# Altium project DS158-1.0-B心电图传感器.PrjPcb
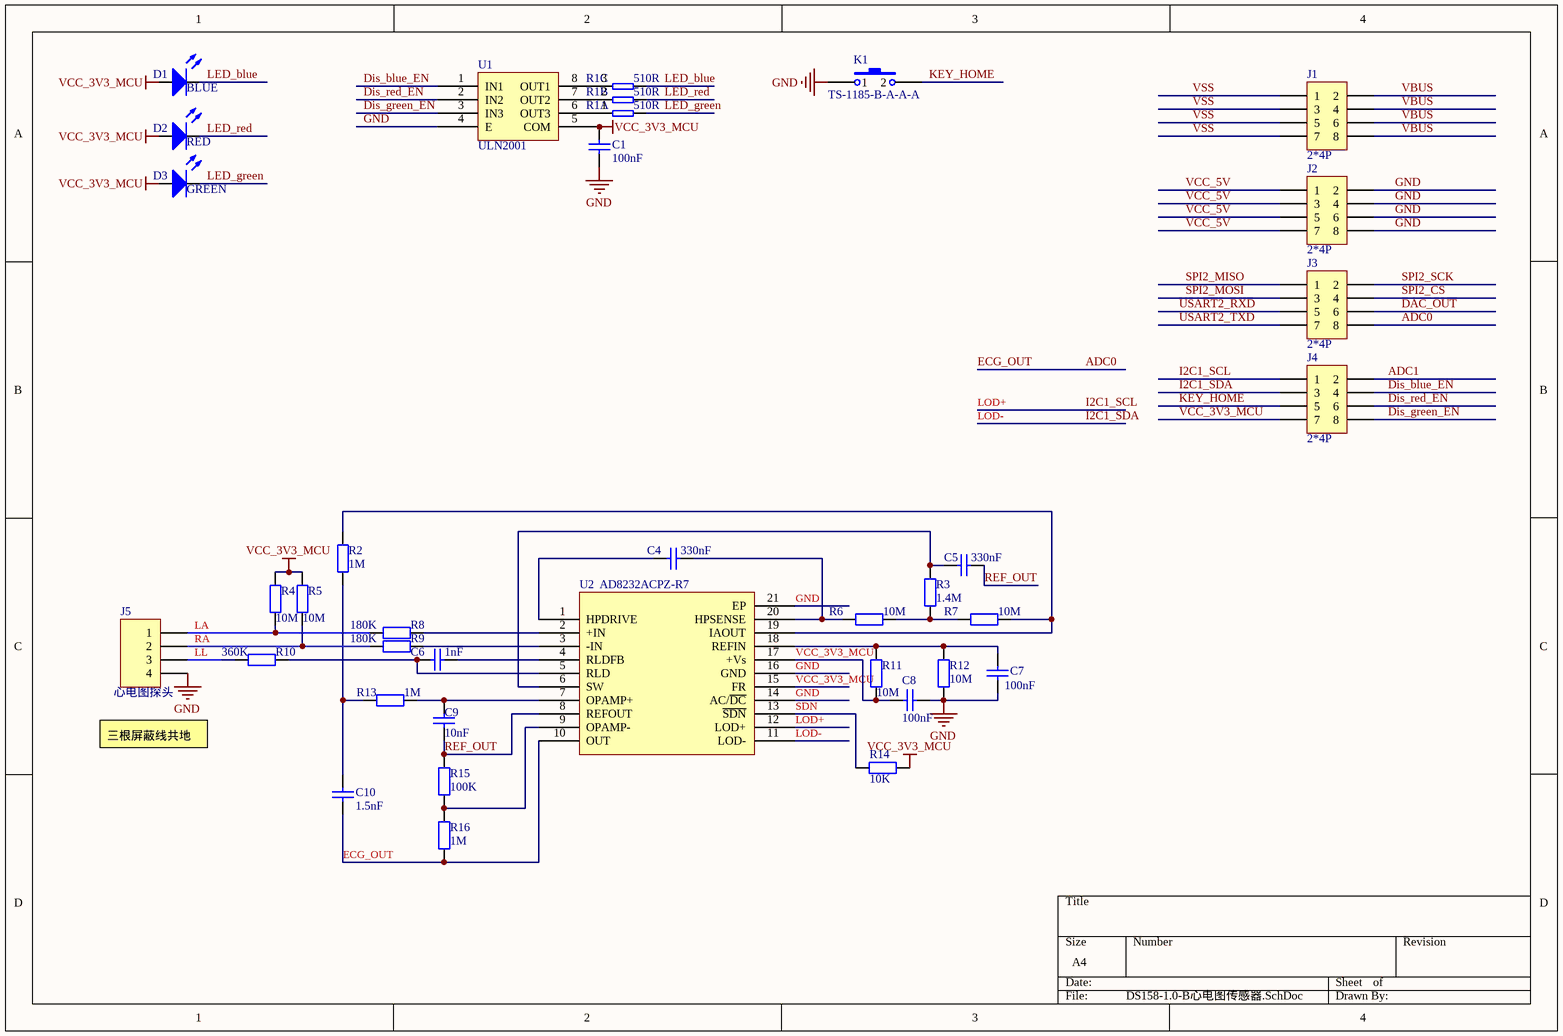
[diagram p0: DS158-1.0-B心电图传感器.SchDoc]
1 sheet, 35 parts. Net scope: global (net labels, ports and power ports of the same name join across sheets).
Board file: DS158-1.0-B心电图传感器.PcbDoc

## Sheet DS158-1.0-B心电图传感器.SchDoc
size A4; SheetNumber: 1; SheetTotal: 1

### Parts
C1  value 100nF  [0603CAP]  (hidden comment: SMDCAP00013)
C4  value 330nF  [0603CAP]  (hidden comment: MLCC 330nF 50V ±5％ 0603)
C5  value 330nF  [0603CAP]  (hidden comment: MLCC 330nF 50V ±5％ 0603)
C6  value 1nF  [0603CAP]  (hidden comment: SMDCAP00008)
C7  value 100nF  [0603CAP]  (hidden comment: SMDCAP00013)
C8  value 100nF  [0603CAP]  (hidden comment: SMDCAP00013)
C9  value 10nF  [0603CAP]  (hidden comment: SMDCAP00010)
C10  value 1.5nF  [0603CAP]  (hidden comment: SMDCAP00008)
D1  value BLUE  [LED_0805]  (hidden comment: SMDLED00010)
D2  value RED  [LED_0805]  (hidden comment: SMDLED00003)
D3  value GREEN  [LED_0805]  (hidden comment: Chip 翠绿LED 0805)
J1  value 2*4P  [X1321WVS-2x04J-C40D53]  (hidden comment: X1321WVS-2x04J-C40D53)
J2  value 2*4P  [X1321WVS-2x04J-C40D53]  (hidden comment: X1321WVS-2x04J-C40D53)
J3  value 2*4P  [X1321WVS-2x04J-C40D53]  (hidden comment: X1321WVS-2x04J-C40D53)
J4  value 2*4P  [X1321WVS-2x04J-C40D53]  (hidden comment: X1321WVS-2x04J-C40D53)
J5  value 心电图探头  [SIP4]  (hidden comment: SL000000042)
K1  TS-1185-B-A-A-A  [KEY_TS-1185-x-A-A-A]
R1  value 510R  [0603RES_Pack4]  (hidden comment: SMDRES05003)  (parts A,B,C of 4)
R2  value 1M  [0603RES]  (hidden comment: SMDRES00085)
R3  value 1.4M  [0603RES]  (hidden comment: SMDRES00085)
R4  value 10M  [0603RES]  (hidden comment: Chip 10M 1/16W ±1％ 0603)
R5  value 10M  [0603RES]  (hidden comment: Chip 10M 1/16W ±1％ 0603)
R6  value 10M  [0603RES]  (hidden comment: Chip 10M 1/16W ±1％ 0603)
R7  value 10M  [0603RES]  (hidden comment: Chip 10M 1/16W ±1％ 0603)
R8  value 180K  [0603RES]  (hidden comment: Chip 180K 1/16W ±1％ 0603)
R9  value 180K  [0603RES]  (hidden comment: Chip 180K 1/16W ±1％ 0603)
R10  value 360K  [0603RES]  (hidden comment: Chip 360K 1/16W ±1％ 0603)
R11  value 10M  [0603RES]  (hidden comment: Chip 10M 1/16W ±1％ 0603)
R12  value 10M  [0603RES]  (hidden comment: Chip 10M 1/16W ±1％ 0603)
R13  value 1M  [0603RES]  (hidden comment: SMDRES00085)
R14  value 10K  [0603RES]  (hidden comment: SMDRES00056)
R15  value 100K  [0603RES]  (hidden comment: SMDRES00071)
R16  value 1M  [0603RES]  (hidden comment: SMDRES00085)
U1  value ULN2001  [SO-8]  (hidden comment: SMDIC000018)
U2  value AD8232ACPZ-R7  [LFCSP_WQ]  (hidden comment: SMDIC000016)

### Nets
GND: C1.1 C7.1 C8.2 J2.2 J2.4 J2.6 J2.8 J5.4 K1.1 R12.2 U1.4(E) U2.14(AC/~{DC}) U2.16(GND) U2.21(EP)
VCC_3V3_MCU: C1.2 C8.1 D1.1(A) D2.1(A) D3.1(A) J4.7 R4.2 R5.2 R11.1 R14.2 U1.5(COM) U2.15(FR) U2.17(+Vs)
ADC0: C10.2 J3.8 R16.2 U2.10(OUT)  [also labelled ECG_OUT]
ADC1: J4.2
DAC_OUT: J3.6
Dis_blue_EN: J4.4 U1.1(IN1)
Dis_green_EN: J4.8 U1.3(IN3)
Dis_red_EN: J4.6 U1.2(IN2)
I2C1_SCL: J4.1 U2.12(LOD+)  [also labelled LOD+]
I2C1_SDA: J4.3 U2.11(LOD-)  [also labelled LOD-]
KEY_HOME: J4.5 K1.2
LA: J5.1 R4.1 R8.1
LED_blue: D1.2(K) R1.6
LED_green: D3.2(K) R1.8
LED_red: D2.2(K) R1.7
LL: J5.3 R10.2
RA: J5.2 R5.1 R9.1
REF_OUT: C5.1 C9.2 R15.1 U2.8(REFOUT)
SDN: R14.1 U2.13(~{SDN})
SPI2_CS: J3.4
SPI2_MISO: J3.1
SPI2_MOSI: J3.3
SPI2_SCK: J3.2
USART2_RXD: J3.5
USART2_TXD: J3.7
VBUS: J1.2 J1.4 J1.6 J1.8
VCC_5V: J2.1 J2.3 J2.5 J2.7
VSS: J1.1 J1.3 J1.5 J1.7
NetC4_1: C4.1 U2.1(HPDRIVE)
NetC4_2: C4.2 R6.2 U2.20(HPSENSE)
NetC5_2: C5.2 R3.2 U2.6(SW)
NetC6_1: C6.1 R10.1 U2.5(RLD)
NetC6_2: C6.2 U2.4(RLDFB)
NetC7_2: C7.2 R11.2 R12.1 U2.18(REFIN)
NetC9_1: C9.1 R13.2 U2.7(OPAMP+)
NetC10_1: C10.1 R2.2 R13.1
NetR1_1: R1.1 U1.6(OUT3)
NetR1_2: R1.2 U1.7(OUT2)
NetR1_3: R1.3 U1.8(OUT1)
NetR2_1: R2.1 R7.2 U2.19(IAOUT)
NetR3_1: R3.1 R6.1 R7.1
NetR8_2: R8.2 U2.2(+IN)
NetR9_2: R9.2 U2.3(-IN)
NetR15_2: R15.2 R16.1 U2.9(OPAMP-)

### Notes on the sheet
- 三根屏蔽线共地

### Library data of the parts
C1 C7 C8 = MLCC 100nF 50V ±10％ 0603: 贴片电容
C4 C5 = MLCC 330nF 50V ±5％ 0603: 贴片电容
C6 = MLCC 1nF 50V ±10％ 0603: 贴片电容
C9 = MLCC 10nF 50V ±10％ 0603: 贴片电容
C10 = MLCC 1.5nF 50V ±10％ 0603: 贴片电容
D1 = Chip 蓝色LED 0805: 贴片LED
D2 = Chip 红色LED 0805: 贴片LED
D3 = Chip 翠绿LED 0805: 贴片LED
J1-J4 = X1321WVS-2x04J-C40D53: 双排针2x4P 立贴 1.27mm
J5 = DIP4 单排直针 间距2.54mm 针长11mm 铜
K1 = TS-1185-B-A-A-A: 轻触开关; Value: TS-1185-B-A-A-A
R1 = Chip R*4 510R 1/16W ±5％ 0603: 贴片排阻
R2 R13 R16 = Chip 1M 1/16W ±1％ 0603: 贴片电阻
R3 = Chip 1.4M 1/16W ±1％ 0603: 贴片电阻
R4-R7 R11 R12 = Chip 10M 1/16W ±1％ 0603: 贴片电阻
R8 R9 = Chip 180K 1/16W ±1％ 0603: 贴片电阻
R10 = Chip 360K 1/16W ±1％ 0603: 贴片电阻
R14 = Chip 10K 1/16W ±1％ 0603: 贴片电阻
R15 = Chip 100K 1/16W ±1％ 0603: 贴片电阻
U1 = ULN2001 SOP-8: 电机驱动芯片
U2 = AD8232ACPZ-R7: 仪表放大器